# EAGLE design hello328p-v1 (EAGLE 9.2.0)
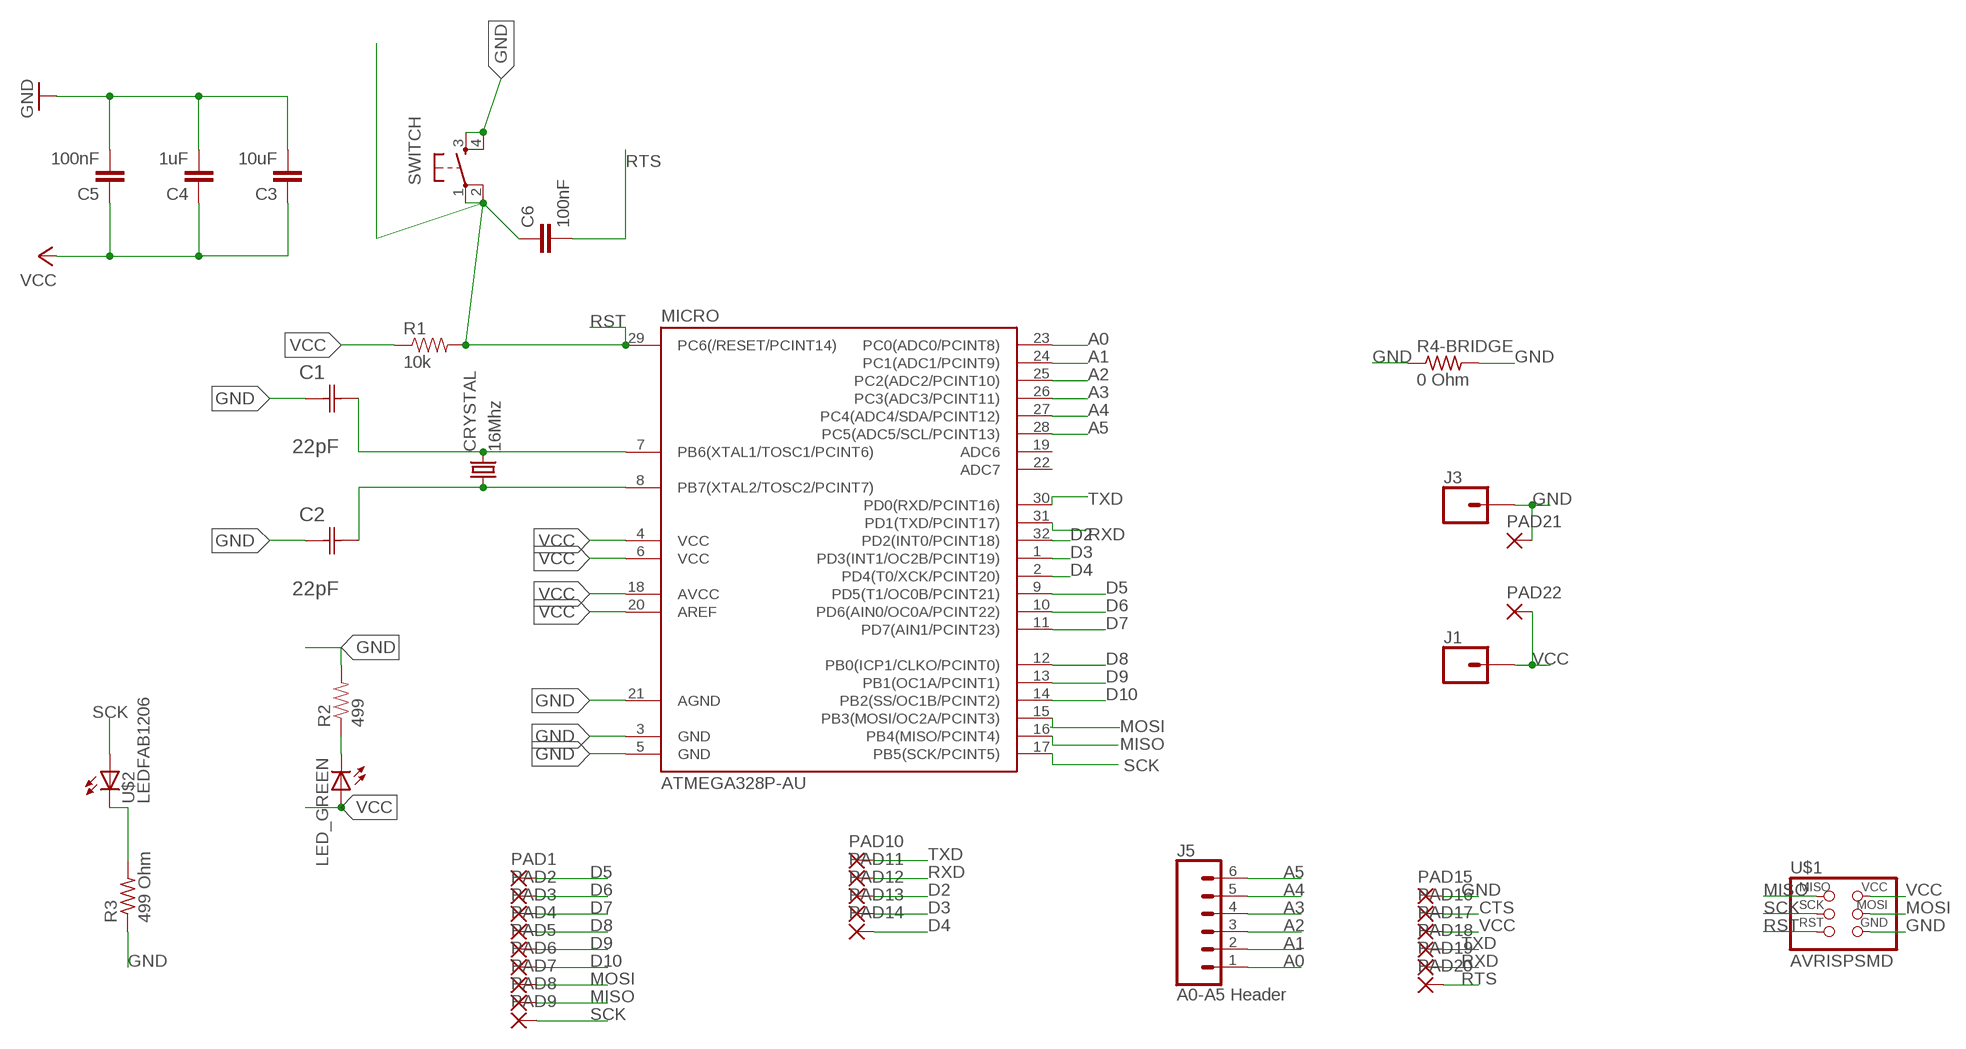
[diagram p0: schematic, sheet 1]

## Parts
C1  22pF  0612ZC225MAT2A  [CAPC3216X178N]
C2  22pF  0612ZC225MAT2A  [CAPC3216X178N]
C3  10uF  CAP1206  [1206]
C4  1uF  CAP1206  [1206]
C5  100nF  CAP1206  [1206]
C6  100nF  CAP1206  [1206]
CRYSTAL  16Mhz  CSM-7X-DU  [CSM-7X-DU]
J1  CONN_01SNAP-MALE  [SNAP-MALE]
J3  CONN_01SNAP-MALE  [SNAP-MALE]
J5  A0-A5 Header  CONN_06SMD_MALE  [1X06_SMD_MALE]
LED_GREEN  LED1206  [1206]
MICRO  ATMEGA328P-AU  ATMEGA48/88/168-AU  [TQFP32-08]
PAD1  SMD2  [SMD1,27-2,54]
PAD2  SMD2  [SMD1,27-2,54]
PAD3  SMD2  [SMD1,27-2,54]
PAD4  SMD2  [SMD1,27-2,54]
PAD5  SMD2  [SMD1,27-2,54]
PAD6  SMD2  [SMD1,27-2,54]
PAD7  SMD2  [SMD1,27-2,54]
PAD8  SMD2  [SMD1,27-2,54]
PAD9  SMD2  [SMD1,27-2,54]
PAD10  SMD2  [SMD1,27-2,54]
PAD11  SMD2  [SMD1,27-2,54]
PAD12  SMD2  [SMD1,27-2,54]
PAD13  SMD2  [SMD1,27-2,54]
PAD14  SMD2  [SMD1,27-2,54]
PAD15  SMD2  [SMD1,27-2,54]
PAD16  SMD2  [SMD1,27-2,54]
PAD17  SMD2  [SMD1,27-2,54]
PAD18  SMD2  [SMD1,27-2,54]
PAD19  SMD2  [SMD1,27-2,54]
PAD20  SMD2  [SMD1,27-2,54]
PAD21  SMD2  [SMD1,27-2,54]
PAD22  SMD2  [SMD1,27-2,54]
R1  10k  RESISTOR1206  [1206]
R2  499  RESISTOR1206  [1206]
R3  499 Ohm  RES-US1206FAB  [R1206FAB]
R4-BRIDGE  0 Ohm  RES-US1206FAB  [R1206FAB]
SWITCH  6MM_SWITCH6MM_SWITCH  [6MM_SWITCH]
U$1  AVRISPSMD  [2X03SMD]
U$2  LEDFAB1206  [LED1206FAB]

## Nets
A0: J5.1 MICRO.23(PC0(ADC0/PCINT8))
A1: J5.2 MICRO.24(PC1(ADC1/PCINT9))
A2: J5.3 MICRO.25(PC2(ADC2/PCINT10))
A3: J5.4 MICRO.26(PC3(ADC3/PCINT11))
A4: J5.5 MICRO.27(PC4(ADC4/SDA/PCINT12))
A5: J5.6 MICRO.28(PC5(ADC5/SCL/PCINT13))
CTS: PAD16.1(P)
D2: MICRO.32(PD2(INT0/PCINT18)) PAD12.1(P)
D3: MICRO.1(PD3(INT1/OC2B/PCINT19)) PAD13.1(P)
D4: MICRO.2(PD4(T0/XCK/PCINT20)) PAD14.1(P)
D5: MICRO.9(PD5(T1/OC0B/PCINT21)) PAD1.1(P)
D6: MICRO.10(PD6(AIN0/OC0A/PCINT22)) PAD2.1(P)
D7: MICRO.11(PD7(AIN1/PCINT23)) PAD3.1(P)
D8: MICRO.12(PB0(ICP1/CLKO/PCINT0)) PAD4.1(P)
D9: MICRO.13(PB1(OC1A/PCINT1)) PAD5.1(P)
D10: MICRO.14(PB2(SS/OC1B/PCINT2)) PAD6.1(P)
GND: C1.1(C1) C2.1(C1) C3.2 C4.2 C5.2 J3.2 MICRO.3(GND) MICRO.5(GND) MICRO.21(AGND) PAD15.1(P) PAD21.1(P) R2.2 R3.1 R4-BRIDGE.1 R4-BRIDGE.2 SWITCH.3(S) SWITCH.4(S1) U$1.6(GND)
MISO: MICRO.16(PB4(MISO/PCINT4)) PAD8.1(P) U$1.1(MISO)
MOSI: MICRO.15(PB3(MOSI/OC2A/PCINT3)) PAD7.1(P) U$1.4(MOSI)
N$1: R3.2 U$2.2(C)
N$2: C1.2(C2) CRYSTAL.2 MICRO.7(PB6(XTAL1/TOSC1/PCINT6))
N$9: C2.2(C2) CRYSTAL.1 MICRO.8(PB7(XTAL2/TOSC2/PCINT7))
N$26: LED_GREEN.2(C) R2.1
RST: C6.1 MICRO.29(PC6(/RESET/PCINT14)) R1.2 SWITCH.1(P) SWITCH.2(P1) U$1.5(RST)
RTS: C6.2 PAD20.1(P)
RXD: MICRO.31(PD1(TXD/PCINT17)) PAD11.1(P) PAD19.1(P)
SCK: MICRO.17(PB5(SCK/PCINT5)) PAD9.1(P) U$1.3(SCK) U$2.1(A)
TXD: MICRO.30(PD0(RXD/PCINT16)) PAD10.1(P) PAD18.1(P)
VCC: C3.1 C4.1 C5.1 J1.2 LED_GREEN.1(A) MICRO.4(VCC) MICRO.6(VCC) MICRO.18(AVCC) MICRO.20(AREF) PAD17.1(P) PAD22.1(P) R1.1 U$1.2(VCC)
Unconnected: MICRO.19(ADC6) MICRO.22(ADC7)

## Library data of the parts
C1 C2 = AVX_By_element14_Batch_1:0612ZC225MAT2A: Capacitor 1206; MPN: 0612ZC225MAT2A; OC_FARNELL: -; OC_NEWARK: 12N3209; SUPPLIER: AVX; TOLERANCE: ±20%; VALUE: 2.2µF; VOLTAGERATING: 10V
C3-C6 = 01_SparkFun:CAP: Capacitor Standard 0603 ceramic capacitor, and 0.1" leaded capacitor.
CRYSTAL = 01_FAB_Hello:CSM-7X-DU: SMD CRYSTAL Source: www.ecsxtal.com .. Crystal 3.6864MHz CSM_7X_DU.PDF; OC_FARNELL: unknown; OC_NEWARK: unknown
J1 J3 = SparkFun-Connectors:CONN_01: Single connection point. Often used as Generic Header-pin footprint for 0.1 inch spaced/style header connections On any of the 0.1 inch spaced packages, you can populate with these: Break Away Headers - Straight <https://www.sparkfun.com/products/116> (PRT-00116) Break Away Male Headers - Right Angle <https://www.sparkfun.com/products/553> (PRT-00553) Female Headers <https://www.sparkfun.com/products/115> (PRT-00115) Break Away Headers - Machine Pin <https://www.sparkfun.com/products/117> (PRT-00117) Break Away Female Headers - Swiss Machine Pin <https://www.sparkfun.com/products/743> (PRT-00743) This device is also useful as a general connection point to wire up your design to another part of your project. Our various solder wires solder well into these plated through hole pads. Hook-Up Wire - Assortment (Stranded, 22 AWG) <https://www.sparkfun.com/products/11375> (PRT-11375) Hook-Up Wire - Assortment (Solid Core, 22 AWG) <https://www.sparkfun.com/products/11367> (PRT-11367) View the entire wire category on our website here <https://www.sparkfun.com/categories/141> Special notes: SMTSO-256-ET is a "flush mount" nut for a 4-40 screw. We mostly use this on specialty testbeds; it is a nice way to connect hardware to your PCB at an adjustable hieght. Also note, the SNAP packages are for using a snappable style connector. We sell a baggie of snaps and they are also used on two LilyPad designs: Snap Assortment - 30 pack (male and female) <https://www.sparkfun.com/products/11347> (DEV-11347) LilyPad Arduino SimpleSnap <https://www.sparkfun.com/products/10941> (DEV-10941) LilyPad SimpleSnap Protoboard <https://www.sparkfun.com/products/10940> (DEV-10940)
J5 = SparkFun-Connectors:CONN_06: Multi connection point. Often used as Generic Header-pin footprint for 0.1 inch spaced/style header connections On any of the 0.1 inch spaced packages, you can populate with these: Break Away Headers - Straight <https://www.sparkfun.com/products/116> (PRT-00116) Break Away Male Headers - Right Angle <https://www.sparkfun.com/products/553> (PRT-00553) Female Headers <https://www.sparkfun.com/products/115> (PRT-00115) Break Away Headers - Machine Pin <https://www.sparkfun.com/products/117> (PRT-00117) Break Away Female Headers - Swiss Machine Pin <https://www.sparkfun.com/products/743> (PRT-00743) Arduino Stackable Header - 6 Pin <https://www.sparkfun.com/products/9280> (PRT-09280) For SCREWTERMINALS and SPRING TERMINALS visit here: Screw Terimnals on SparkFun.com <https://www.sparkfun.com/search/results?term=Screw+Terminals> (5mm/3.5mm/2.54mm spacing) This device is also useful as a general connection point to wire up your design to another part of your project. Our various solder wires solder well into these plated through hole pads. Hook-Up Wire - Assortment (Stranded, 22 AWG) <https://www.sparkfun.com/products/11375> (PRT-11375) Hook-Up Wire - Assortment (Solid Core, 22 AWG) <https://www.sparkfun.com/products/11367> (PRT-11367) View the entire wire category on our website here <https://www.sparkfun.com/categories/141>; PROD_ID: CONN-11293
LED_GREEN = 01_FAB_Hello:LED
MICRO = atmega8:ATMEGA48/88/168
PAD1-PAD22 = wirepad:SMD2: SMD PAD
R1 R2 = 01_SparkFun:RESISTOR: Resistor Basic schematic elements and footprints for 0603, 1206, and PTH 1/10th watt (small) resistors.
R3 R4-BRIDGE = fab:RES-US: Resistor (US Symbol) Variants with postfix FAB are widened to allow the routing of internal traces
SWITCH = 01_FAB_Hello:6MM_SWITCH: OMRON SWITCH
U$1 = fab:AVRISP
U$2 = fab:LED: LED

## Board
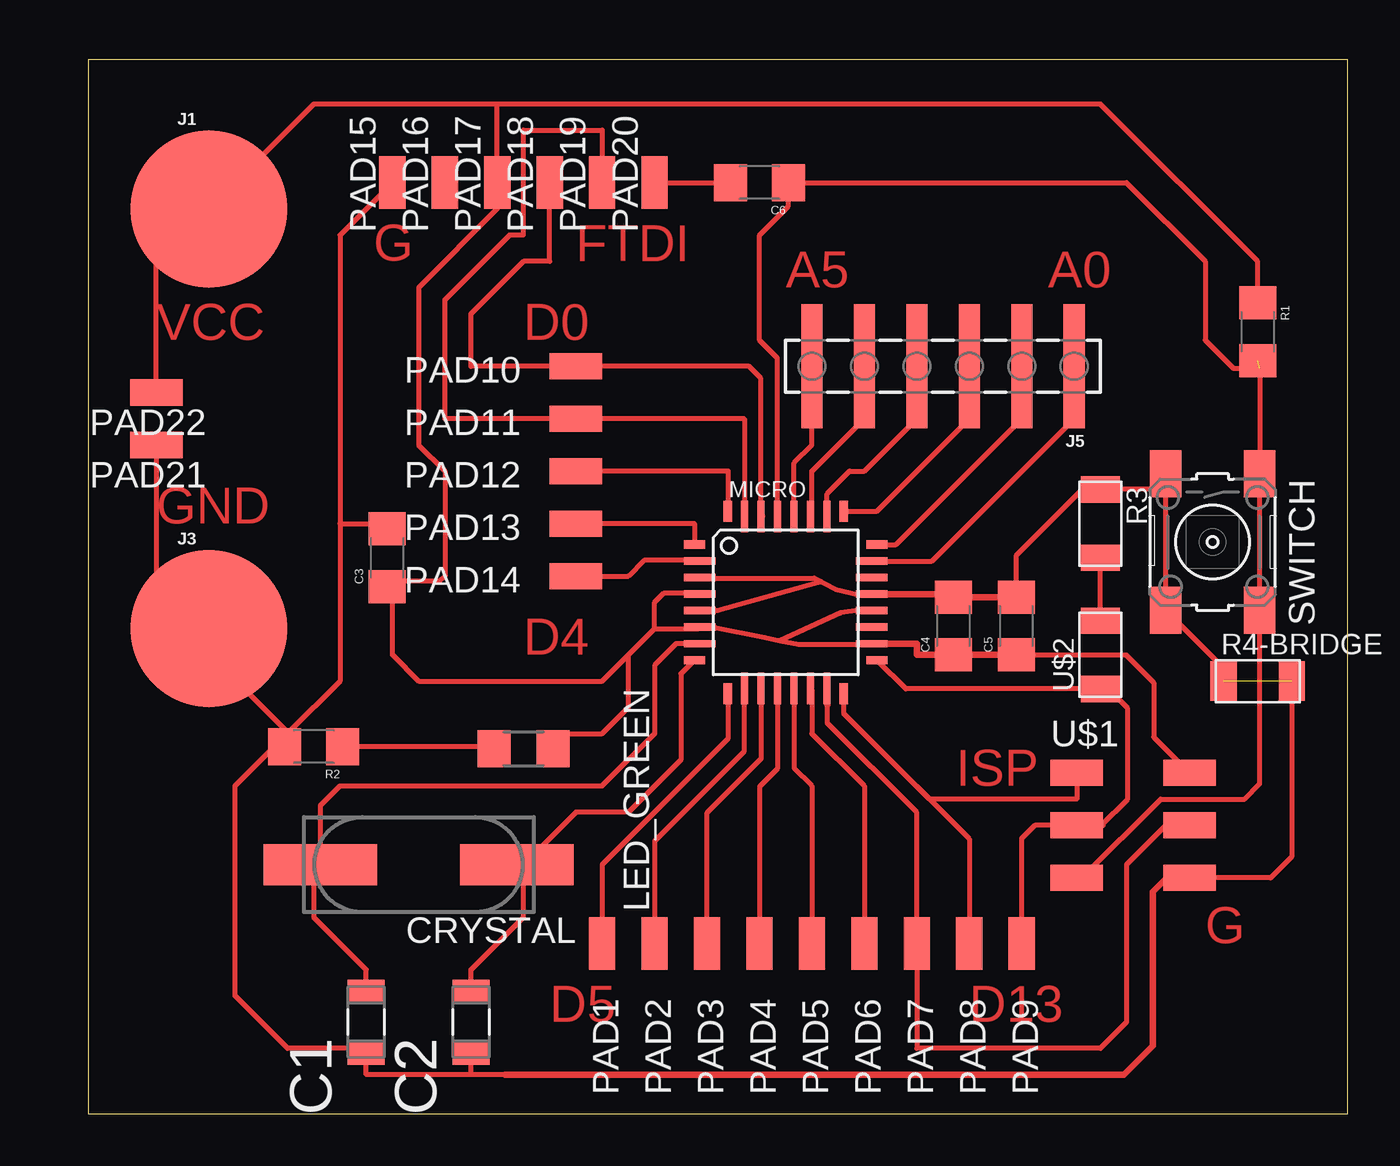
[diagram p1: board, top side]

Size 61.01 x 51.04 mm. Coordinates in mm from the lower left corner, seen from the top.
Outline: 0,0 61.01,0 61.01,51.04 0,51.04 0,0
Copper layers (1*16): Top 0.035mm / dielectric 1.5mm / Bottom 0.035mm
Design rules "default": minimum track width 10mil, minimum drill 24mil, track to track 8mil, track to pad 8mil, pad to pad 8mil, via to via 8mil, smd to smd 8mil, copper to edge 40mil, drill to drill 8mil, minimum pad ring 10mil, minimum via ring 8mil, stop-mask expansion 4mil, vias tented up to drill 0mil, thermal gap 10mil

### Footprints (pad centres in the part's own frame; a part is rotated, then mirrored left to right if it is on the bottom)
CAPC3216X178N = smd 1.118 x 1.803: 1 -1.499,0; 2 1.499,0
1206 = smd 1.6 x 1.8: 1 -1.4,0; 2 1.4,0
CSM-7X-DU = smd 5.5 x 2: 1 -4.75,0; 2 4.75,0
SNAP-MALE = smd 7.62 x 7.62: 2 0,0
1X06_SMD_MALE = smd 1.02 x 6: 1 0,0; 2 2.54,0; 3 5.08,0; 4 7.62,0; 5 10.16,0; 6 12.7,0
1206' = smd 1.6 x 1.803: 1 -1.422,0; 2 1.422,0
TQFP32-08 = smd 1.016 x 0.406: 1 -4.42,2.8; 8 -4.42,-2.8; 17 4.42,-2.8; 24 4.42,2.8 | smd 1.524 x 0.356: 2 -4.166,2; 3 -4.166,1.2; 4 -4.166,0.4; 5 -4.166,-0.4; 6 -4.166,-1.2; 7 -4.166,-2; 18 4.166,-2; 19 4.166,-1.2; 20 4.166,-0.4; 21 4.166,0.4; 22 4.166,1.2; 23 4.166,2 | smd 0.406 x 1.016: 9 -2.8,-4.42; 16 2.8,-4.42; 25 2.8,4.42; 32 -2.8,4.42 | smd 0.356 x 1.524: 10 -2,-4.166; 11 -1.2,-4.166; 12 -0.4,-4.166; 13 0.4,-4.166; 14 1.2,-4.166; 15 2,-4.166; 26 2,4.166; 27 1.2,4.166; 28 0.4,4.166; 29 -0.4,4.166; 30 -1.2,4.166; 31 -2,4.166
SMD1,27-2,54 = smd 1.27 x 2.54: 1 0,0
R1206FAB = smd 1.27 x 1.905: 1 -1.651,0; 2 1.651,0
6MM_SWITCH = smd 2.286 x 1.524: 1 -3.302,2.286; 2 3.302,2.286; 3 -3.302,-2.286; 4 3.302,-2.286
2X03SMD = smd 2.54 x 1.27: 1 -2.54,2.54; 2 2.92,2.54; 3 -2.54,0; 4 2.92,0; 5 -2.54,-2.54; 6 2.92,-2.54
LED1206FAB = smd 1.27 x 1.905: 1 -1.651,0; 2 1.651,0

### Placement (x,y rotation side)
C1  13.46,4.45 90 top
C2  18.54,4.45 90 top
C3  14.48,26.92 90 top
C4  41.91,23.62 90 top
C5  44.96,23.62 90 top
C6  32.51,45.09 180 top
CRYSTAL  16,12.07 180 top
J1  5.84,43.81 0 top
J3  5.84,23.5 0 top
J5  47.75,36.2 180 top
LED_GREEN  [1206']  21.08,17.68 180 top
MICRO  33.78,24.77 0 top
PAD1  24.89,8.26 180 top
PAD2  27.43,8.26 180 top
PAD3  29.97,8.26 180 top
PAD4  32.51,8.26 180 top
PAD5  35.05,8.26 180 top
PAD6  37.59,8.26 180 top
PAD7  40.13,8.26 180 top
PAD8  42.67,8.26 180 top
PAD9  45.21,8.26 180 top
PAD10  23.62,36.2 90 top
PAD11  23.62,33.66 90 top
PAD12  23.62,31.12 90 top
PAD13  23.62,28.57 90 top
PAD14  23.62,26.04 90 top
PAD15  14.73,45.09 0 top
PAD16  17.27,45.09 0 top
PAD17  19.81,45.09 0 top
PAD18  22.35,45.09 0 top
PAD19  24.89,45.09 0 top
PAD20  27.43,45.09 0 top
PAD21  3.3,32.39 90 top
PAD22  3.3,34.92 90 top
R1  56.64,37.87 270 top
R2  10.92,17.78 180 top
R3  49.02,28.57 270 top
R4-BRIDGE  56.64,20.96 0 top
SWITCH  54.46,27.69 270 top
U$1  50.42,13.97 0 top
U$2  49.02,22.23 90 top

### Tracks (layer width: path | path; a pad name or v marks a point on that pad's centre or on a via)
A0
  Top 0.254: MICRO.23 40.86,26.77 47.75,33.66 J5.1
A1
  Top 0.254: MICRO.24 39.12,27.57 45.21,33.66 J5.2
A2
  Top 0.254: MICRO.25 38.2,29.18 42.67,33.66 J5.3
A3
  Top 0.254: MICRO.26 35.78,30.02 36.88,31.12 37.59,31.12 40.13,33.66 J5.4
A4
  Top 0.254: MICRO.27 35.05,29 35.05,31.12 37.59,33.66 J5.5
A5
  Top 0.254: MICRO.28 34.18,31.52 35.05,32.39 J5.6
D2
  Top 0.254: PAD12.1 30.99,31.12 MICRO.32
D3
  Top 0.254: PAD13.1 29.36,28.57 MICRO.1
D4
  Top 0.254: PAD14.1 26.16,26.04 26.92,26.8 29.58,26.8 MICRO.2
D5
  Top 0.254: MICRO.9 30.98,18.16 24.89,12.07 PAD1.1
D6
  Top 0.254: MICRO.10 31.75,20.57 31.75,17.53 27.43,13.21 PAD2.1
D7
  Top 0.254: PAD3.1 29.97,14.58 32.59,17.2 MICRO.11
D8
  Top 0.254: MICRO.12 33.38,16.72 32.51,15.85 PAD4.1
D9
  Top 0.254: MICRO.13 34.18,16.75 35.05,15.88 PAD5.1
D10
  Top 0.254: MICRO.14 35.05,20.53 35.05,18.41 37.59,15.88 PAD6.1
GND  (1 unrouted)
  Top 0.254: MICRO.3 29.64,25.94 35.17,25.94 | 35.17,25.94 36.2,25.4 37.34,25.15 | 30.23,24.38 30.48,24.38 35.36,25.73 | 35.36,25.73 35.49,25.77 | 35.17,25.94 35.36,25.73 | C4.2 44.32,25.02 | C5.2 44.96,27.05 48.13,30.23 R3.1 49.05,30.25 51.44,30.25 SWITCH.3 52.17,24.41 52.2,24.38 | 20.19,1.91 18.54,1.91 | 18.54,1.91 13.46,1.91 C1.1 13.23,3.18 9.65,3.18 7.11,5.71 7.11,15.88 9.68,18.45 | 9.68,18.45 10.19,18.45 R2.2 | 12.19,28.57 12.19,20.96 9.68,18.45 | 12.19,28.57 14.73,28.57 | U$1.6 57.28,11.43 58.29,12.45 R4-BRIDGE.2 | R4-BRIDGE.1 54.99,21.34 54.74,21.59 54.74,21.84 52.2,24.38 | 52.2,24.38 SWITCH.4 | 18.54,1.91 C2.1 | PAD15.1 12.19,42.55 12.19,28.57 | 9.68,18.45 5.84,22.29 J3.2 3.3,26.04 PAD21.1
  Top 0.305: MICRO.5 | MICRO.21 | 29.62,24.38 MICRO.5 | MICRO.21 41.91,25.16 C4.2 C5.2 | 30.23,24.38 MICRO.5 | MICRO.21 37.34,25.15 | C3.2 14.73,28.57 | U$1.6 52.25,11.43 51.56,10.74 51.56,3.3 50.16,1.91 20.19,1.91
MISO
  Top 0.254: 37.55,18.44 37.54,18.44 42.67,13.31 PAD8.1 | U$1.1 47.88,15.24 40.75,15.24 37.55,18.44 | 37.55,18.44 36.58,19.41 MICRO.16
  Top 0.305: MICRO.16
MOSI
  Top 0.254: MICRO.15 35.78,18.95 40.13,14.6 PAD7.1 40.13,3.18 49.02,3.18 50.29,4.45 50.29,12.07 52.2,13.97 U$1.4
  Top 0.305: MICRO.15 35.81,19.81
N$1
  Top 0.254: U$2.2 R3.2
N$2
  Top 0.254: MICRO.7 28.48,22.77 27.43,21.72 27.43,18.41 24.89,15.88 12.19,15.88 11.25,14.94 CRYSTAL.2 10.92,11.73 10.92,9.53 13.46,6.99 C1.2
  Top 0.305: 29.62,22.73 MICRO.7
N$9
  Top 0.254: MICRO.8 28.7,21.31 28.7,17.14 26.16,14.61 23.62,14.61 21.08,12.07 | C2.2 18.54,6.99 21.08,9.53 21.08,12.07 | CRYSTAL.1 21.08,12.07
  Top 0.305: MICRO.8
N$26
  Top 0.254: R2.1 19.56,17.78 LED_GREEN.2
RST  (1 unrouted)
  Top 0.254: U$1.5 48.13,11.43 51.94,15.24 56.01,15.24 56.74,15.98 SWITCH.2 SWITCH.1 56.74,36.09 55.47,36.09 54.1,37.47 54.1,41.27 50.29,45.09 C6.1 | MICRO.29 33.38,36.59 32.51,37.47 32.51,42.55 33.91,43.95 C6.1 | 34.17,45.34 C6.1
  Top 0.305: MICRO.29 33.4,28.93
RTS
  Top 0.254: PAD20.1 C6.2
RXD
  Top 0.254: MICRO.31 31.78,33.66 PAD11.1 17.27,33.66 17.27,39.42 20.4,42.55 21.08,42.55 21.08,47.62 24.89,47.62 PAD19.1
  Top 0.305: MICRO.31 31.75,28.93
SCK
  Top 0.254: MICRO.17 39.59,20.57 U$2.1 49.4,20.57 50.34,19.63 50.34,15.24 49.07,13.97 U$1.3 | 49.15,13.97 U$1.3 | PAD9.1 45.21,13.34 45.85,13.97 U$1.3
TXD
  Top 0.254: MICRO.30 32.58,35.62 32,36.2 PAD10.1 18.54,36.2 18.54,38.73 21.08,41.27 22.35,41.27 PAD18.1
  Top 0.305: MICRO.30 32.64,28.93
VCC
  Top 0.254: 30.3,23.57 32.76,23.07 33.51,22.92 | 33.51,22.92 34.42,22.73 37.95,22.73 | MICRO.20 37.34,24.37 37.34,24.38 36.45,24.26 33.51,22.92 | C5.1 50.27,22.22 51.61,20.88 51.61,18.24 U$1.2 | 19.81,48.9 10.92,48.9 J1.2 3.3,41.27 PAD22.1 | 14.73,26.04 14.73,25.78 | 14.73,25.78 C3.1 14.73,25.27 14.73,22.23 16,20.96 24.89,20.96 26.16,22.23 | 14.73,25.78 17.02,25.78 17.27,26.04 17.27,31.12 16,32.39 16,40.01 19.81,43.81 PAD17.1 19.81,48.9 | R1.1 56.64,41.27 49.02,48.9 19.81,48.9 | 22.9,17.68 LED_GREEN.1 23.24,18.41 24.89,18.41 26.16,19.69 26.16,22.23 | 26.16,22.23 27.43,23.5 | 27.43,23.5 29.55,23.5 MICRO.6 | 27.43,23.5 27.43,24.77 27.89,25.22 29.56,25.22 MICRO.4
  Top 0.305: MICRO.18 | MICRO.20 37.34,24.38 | 37.95,22.73 MICRO.18 | 30.3,23.57 MICRO.6 | MICRO.18 40.13,22.77 40.13,22.23 C4.1 C5.1

### Text on the board
Top: G | FTDI | A5 | A0 | VCC | D0 | GND | D4 | ISP | G | D5 | D13